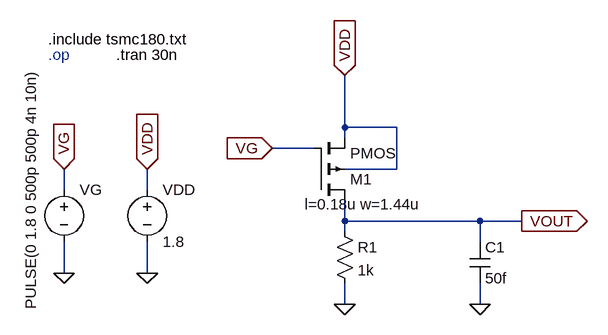
[diagram p0: schematic Pmos_strong1_weak0.asc]
Pmos_strong1_weak0.asc, the LTspice schematic file:
Version 4
SHEET 1 880 680
WIRE 368 80 368 0
WIRE 448 80 368 80
WIRE 368 96 368 80
WIRE 320 112 256 112
WIRE 448 144 448 80
WIRE 448 144 368 144
WIRE -64 176 -64 144
WIRE 64 176 64 144
WIRE 368 224 368 192
WIRE 576 224 368 224
WIRE 640 224 576 224
WIRE 368 240 368 224
WIRE 576 256 576 224
WIRE -64 304 -64 256
WIRE 64 304 64 256
WIRE 368 352 368 320
WIRE 576 352 576 320
FLAG 368 352 0
FLAG 64 304 0
FLAG -64 304 0
FLAG 64 144 VDD
IOPIN 64 144 In
FLAG 368 0 VDD
IOPIN 368 0 In
FLAG 256 112 VG
IOPIN 256 112 In
FLAG -64 144 VG
IOPIN -64 144 In
FLAG 640 224 VOUT
IOPIN 640 224 Out
FLAG 576 352 0
SYMBOL pmos4 320 192 M180
WINDOW 123 -14 -6 Left 2
SYMATTR InstName M1
SYMATTR Value2 l=0.18u w=1.44u
SYMBOL voltage 64 160 R0
WINDOW 123 0 0 Left 0
WINDOW 39 0 0 Left 0
SYMATTR InstName VDD
SYMATTR Value 1.8
SYMBOL voltage -64 160 R0
WINDOW 3 -51 -171 VRight 2
WINDOW 123 0 0 Left 0
WINDOW 39 0 0 Left 0
SYMATTR InstName VG
SYMATTR Value PULSE(0 1.8 0 500p 500p 4n 10n)
SYMBOL res 352 224 R0
SYMATTR InstName R1
SYMATTR Value 1k
SYMBOL cap 560 256 R0
SYMATTR InstName C1
SYMATTR Value 50f
TEXT -88 -56 Left 2 !.include tsmc180.txt
TEXT -88 -32 Left 2 ;.op
TEXT 16 -32 Left 2 !.tran 30n

The netlist it stands for:
* Pmos_strong1_weak0.asc
M1 VOUT VG VDD VDD PMOS l=0.18u w=1.44u
VDD VDD 0 1.8
VG VG 0 PULSE(0 1.8 0 500p 500p 4n 10n)
R1 VOUT 0 1k
C1 VOUT 0 50f
.model NMOS NMOS
.model PMOS PMOS
.lib standard.mos
.include tsmc180.txt
* .op
.tran 30n
.backanno
.end